# Altium schematic sheet Top.SchDoc
size A2; SheetNumber: 2; SheetTotal: 9
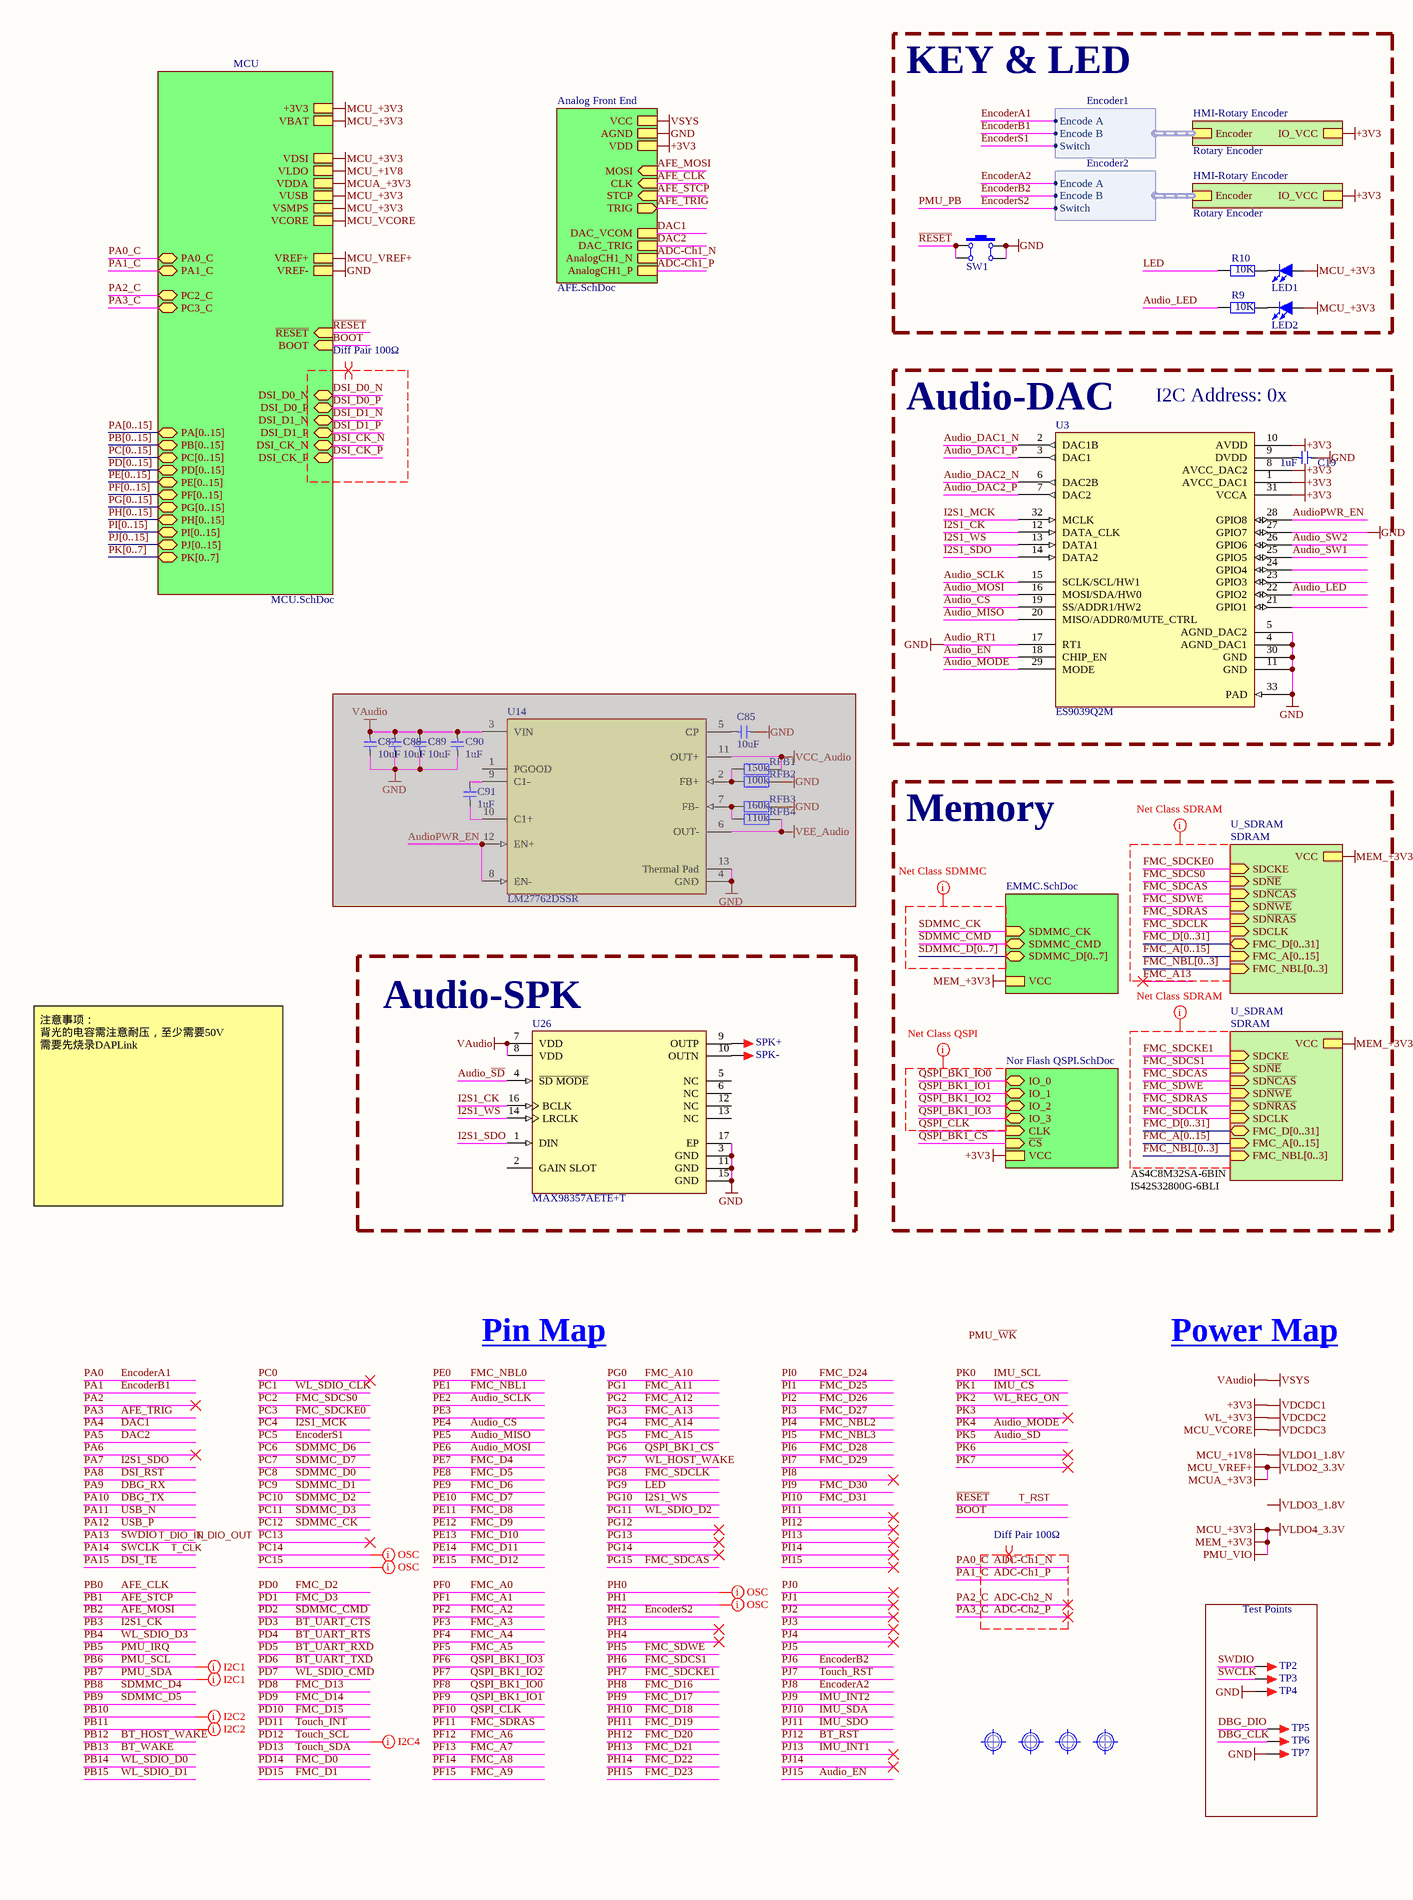
[diagram p0: Top.SchDoc, left]
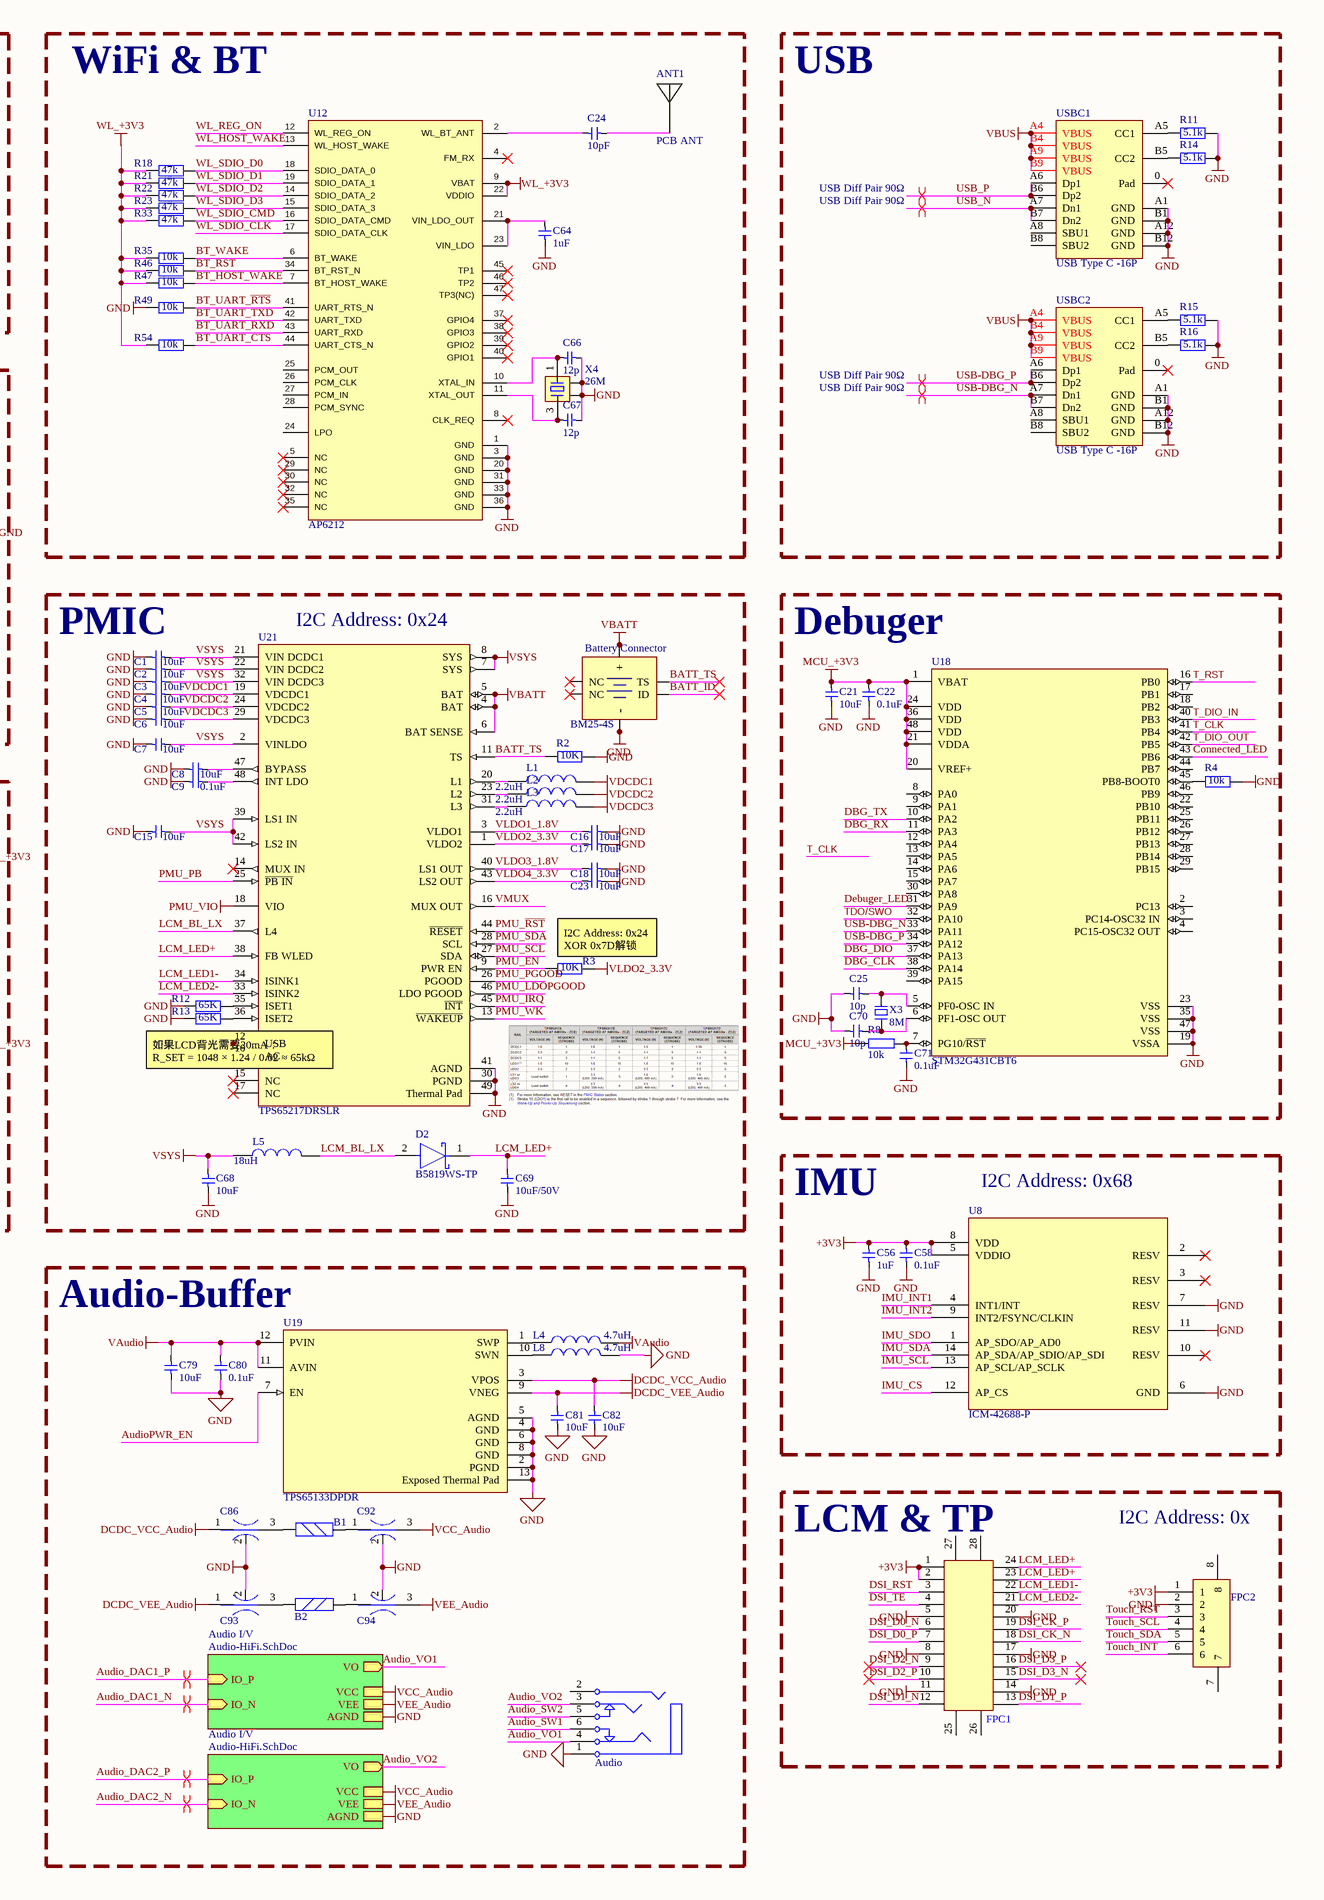
[diagram p1: Top.SchDoc, right]

## Parts
ANT1  PCB ANT  [WIFI-ANT]
Audio  PJ342  [PJ342A]  (value not drawn)
B1  BLM15AG601SN1D  [L0603]  (value not drawn)
B2  BLM15AG601SN1D  [L0603]  (value not drawn)
Battery_Connector  BM25-4S  [BM25-4S/2-V-51]
C1  10uF  [0603-C]
C2  10uF  [0603-C]
C3  10uF  [0603-C]
C4  10uF  [0603-C]
C5  10uF  [0603-C]
C6  10uF  [0603-C]
C7  10uF  [0603-C]
C8  10uF  [0603-C]
C9  0.1uF  [0603-C]
C15  10uF  [0603-C]
C16  10uF  [0603-C]
C17  10uF  [0603-C]
C18  10uF  [0603-C]
C19  1uF  [0402-C]
C21  10uF  [0402-C]
C22  0.1uF  [0402-C]
C23  10uF  [0603-C]
C24  10pF  [0402-C]
C25  10p  [0402-C]
C56  1uF  [0402-C]
C58  0.1uF  [0402-C]
C64  1uF  [0402-C]
C66  12p  [0402-C]
C67  12p  [0402-C]
C68  10uF  [0603-C]
C69  10uF/50V  [0603-C]
C70  10p  [0402-C]
C71  0.1uF  [0402-C]
C79  10uF  [0402-C]
C80  0.1uF  [0402-C]
C81  10uF  [0402-C]
C82  10uF  [0402-C]
C85  10uF  [0402-C]  (masked out: inside a compile mask, not in the netlist)
C86  NFM18PS105D0J3D  [FP-NFM18-0_1-e0_05_0_35-MFG]  (value not drawn)
C87  10uF  [0402-C]  (masked out: inside a compile mask, not in the netlist)
C88  10uF  [0402-C]  (masked out: inside a compile mask, not in the netlist)
C89  10uF  [0402-C]  (masked out: inside a compile mask, not in the netlist)
C90  1uF  [0402-C]  (masked out: inside a compile mask, not in the netlist)
C91  1uF  [0402-C]  (masked out: inside a compile mask, not in the netlist)
C92  NFM18PS105D0J3D  [FP-NFM18-0_1-e0_05_0_35-MFG]  (value not drawn)
C93  NFM18PS105D0J3D  [FP-NFM18-0_1-e0_05_0_35-MFG]  (value not drawn)
C94  NFM18PS105D0J3D  [FP-NFM18-0_1-e0_05_0_35-MFG]  (value not drawn)
D2  B5819WS-TP  [FP-SOD-323-IPC_C]
FPC1  OK-06F024-04  [OK-06F024-04]  (value not drawn)
FPC2  AFC01-S06FCA-00  [FPC-SMD_P0.50-6P_AFC01-S06FCA-00]  (value not drawn)
L1  2.2uH  [L0805]
L2  2.2uH  [L0805]
L3  2.2uH  [L0805]
L4  4.7uH  [L0805]
L5  18uH  [L0805]
L8  4.7uH  [L0805]
LED1  红色  [LED0603_B]  (value not drawn)
LED2  红色  [LED0603_B]  (value not drawn)
MR1  MARK1.6  [Mark 1]  (value not drawn)
MR2  MARK1.6  [Mark 1]  (value not drawn)
MR3  MARK1.6  [Mark 1]  (value not drawn)
MR4  MARK1.6  [Mark 1]  (value not drawn)
R2  10K  [0402-R]
R3  10K  [0603-R]
R4  10k  [0402-R]
R8  10k  [0402-R]
R9  10K  [0402-R]
R10  10K  [0402-R]
R11  5.1k  [0402-R]
R12  65K  [0402-R]
R13  65K  [0402-R]
R14  5.1k  [0402-R]
R15  5.1k  [0402-R]
R16  5.1k  [0402-R]
R18  47k  [0402-R]
R21  47k  [0402-R]
R22  47k  [0402-R]
R23  47k  [0402-R]
R33  47k  [0402-R]
R35  10k  [0402-R]
R46  10k  [0402-R]
R47  10k  [0402-R]
R49  10k  [0402-R]
R54  10k  [0402-R]
RFB1  150k  [0402-R]  (masked out: inside a compile mask, not in the netlist)
RFB2  100k  [0402-R]  (masked out: inside a compile mask, not in the netlist)
RFB3  160k  [0402-R]  (masked out: inside a compile mask, not in the netlist)
RFB4  110k  [0402-R]  (masked out: inside a compile mask, not in the netlist)
SPK+  (no value)  [SMD_L2.2-W1.0_KH-221020-TP]
SPK-  (no value)  [SMD_L2.2-W1.0_KH-221020-TP]
SW1  TD-1187SA-250  [SW-SMD-3.5*3.0_4P]  (value not drawn)
TP2  (no value)  [TEST 1]
TP3  (no value)  [TEST 1]
TP4  (no value)  [TEST 1]
TP5  (no value)  [SMD_L2.2-W1.0_KH-221020-TP]
TP6  (no value)  [SMD_L2.2-W1.0_KH-221020-TP]
TP7  (no value)  [TEST 1]
U3  ES9039Q2M  [QFN32 5x5_L]
U8  ICM-42688-P  [LGA-14_L3.0-W2.5-P0.50-TL]
U12  AP6212  [QFN-44_L12.0-W12.0-P0.90-TL]
U14  LM27762DSSR  [FP-DSS0012B-MFG]  (masked out: inside a compile mask, not in the netlist)
U18  STM32G431CBT6  [FP-LQFP48-5B-MFG]
U19  TPS65133DPDR  [FP-DPD0012A-MFG]
U21  TPS65217DRSLR  [FP-RSL0048A-MFG]
U26  MAX98357AETE+T  [FP-T1633-4-MFG]
USBC1  USB Type C -16P  [USB-C-SMD_16P]
USBC2  USB Type C -16P  [USB-C-SMD_16P]
X3  8M  [XTAL-3215-2P]
X4  26M  [XTAL-3225-4P]

## Blocks framed on the sheet
KEY & LED: LED1 LED2 R9 R10 SW1
WiFi & BT: ANT1 C24 C64 C66 C67 R18 R21-R23 R33 R35 R46 R47 R49 R54 U12 X4
USB: R11 R14-R16 USBC1 USBC2
Audio-DAC: C19 U3
PMIC: Battery_Connector C1-C9 C15-C18 C23 C68 C69 D2 L1-L3 L5 R2 R3 R12 R13 U21
Debuger: C21 C22 C25 C70 C71 R4 R8 U18 X3
Audio-SPK: SPK+ SPK- U26
IMU: C56 C58 U8
Audio-Buffer: Audio B1 B2 C79-C82 C86 C92-C94 L4 L8 U19
LCM & TP: FPC1 FPC2
Test Points: TP2-TP7

## Sub-sheets
Analog Front End = AFE.SchDoc: AGND, VCC, AnalogCH1_N, AnalogCH1_P, TRIG (out), MOSI (in), CLK (in), STCP (in), VDD, DAC_TRIG, DAC_VCOM
Audio I/V = Audio-HiFi.SchDoc: IO_N (in), IO_P (in), VO (out), VCC, VEE, AGND
Audio I/V = Audio-HiFi.SchDoc: IO_N (in), IO_P (in), VO (out), VCC, VEE, AGND
HMI-Rotary Encoder = Rotary Encoder: Encoder (harness Encoder1), IO_VCC
HMI-Rotary Encoder = Rotary Encoder: Encoder (harness Encoder2), IO_VCC
MCU = MCU.SchDoc: VREF+, +3V3, BOOT (in), ~{RESET} (in), PA[0..15] (bidir), PB[0..15] (bidir), PC[0..15] (bidir), PD[0..15] (bidir), PE[0..15] (bidir), PF[0..15] (bidir), PG[0..15] (bidir), PH[0..15] (bidir), PI[0..15] (bidir), PJ[0..15] (bidir), PK[0..7] (bidir), PA0_C (bidir), PA1_C (bidir), PC2_C (bidir), PC3_C (bidir), DSI_D0_N (bidir), DSI_D0_P (bidir), DSI_D1_N (bidir), DSI_D1_P (bidir), DSI_CK_N (bidir), DSI_CK_P (bidir), VBAT, VREF-, VDSI, VLDO, VDDA, VUSB, VSMPS, VCORE
U_EMMC = EMMC.SchDoc: SDMMC_D[0..7] (bidir), SDMMC_CMD (bidir), SDMMC_CK (in), VCC
U_Nor Flash = Nor Flash QSPI.SchDoc: IO_0 (bidir), IO_1 (bidir), IO_2 (bidir), IO_3 (bidir), CLK (in), ~{CS} (in), VCC
U_SDRAM = SDRAM: SD~{NCAS} (in), SD~{NWE} (in), SD~{NRAS} (in), SD~{NE} (in), SDCKE (in), SDCLK (in), FMC_D[0..31] (bidir), FMC_A[0..15] (in), FMC_NBL[0..3] (in), VCC
U_SDRAM = SDRAM: SD~{NCAS} (in), SD~{NWE} (in), SD~{NRAS} (in), SD~{NE} (in), SDCKE (in), SDCLK (in), FMC_D[0..31] (bidir), FMC_A[0..15] (in), FMC_NBL[0..3] (in), VCC

## Harnesses
Encoder1: Encode A, Encode B, Switch
Encoder2: Encode A, Encode B, Switch

## Nets
Audio_RT1: Audio.1 Battery_Connector.7(-) Battery_Connector.8(-) Battery_Connector.11(-) Battery_Connector.12(-) Battery_Connector.15(-) Battery_Connector.16(-) C1.2 C2.2 C3.2 C4.2 C5.2 C6.2 C7.2 C8.2 C9.2 C15.2 C16.1 C17.1 C18.1 C19.2 C21.1 C22.1 C23.1 C25.1 C56.1 C58.1 C64.1 C66.2 C67.2 C68.1 C69.1 C70.1 C71.2 C79.1 C80.1 C81.1 C82.1 C86.2(GND) C92.2(GND) C93.2(GND) C94.2(GND) FPC1.5 FPC1.8 FPC1.11 FPC1.14 FPC1.17 FPC1.20 FPC2.2 L8.2 R2.2 R4.1 R11.2 R12.1 R13.1 R14.2 R15.2 R16.2 R49.1 SW1.2 SW1.3 TP4.1 TP7.1 U3.4(AGND_DAC1) U3.5(AGND_DAC2) U3.11(GND) U3.17(RT1) U3.27(GPIO7) U3.30(GND) U3.33(PAD) U8.6(GND) U8.7(RESV) U8.11(RESV) U12.1(GND) U12.3(GND) U12.20(GND) U12.31(GND) U12.33(GND) U12.36(GND) U18.19(VSSA) U18.23(VSS) U18.35(VSS) U18.47(VSS) U19.2(PGND) U19.4(GND) U19.5(AGND) U19.6(GND) U19.8(GND) U19.13(Exposed_Thermal_Pad) U21.30(PGND) U21.41(AGND) U21.49(Thermal_Pad) U26.3(GND) U26.11(GND) U26.15(GND) U26.17(EP) USBC1.A1(GND) USBC1.A12(GND) USBC1.B1(GND) USBC1.B12(GND) USBC2.A1(GND) USBC2.A12(GND) USBC2.B1(GND) USBC2.B12(GND) X4.2 X4.4 ; sheet MCU/VREF-, sheet Analog Front End/AGND, sheet Audio I/V/AGND, sheet Audio I/V/AGND  [also labelled GND]
DCDC_VCC_Audio: C82.2 C86.1(Input) U19.3(VPOS)
DCDC_VEE_Audio: C81.2 C93.1(Input) U19.9(VNEG)
VBATT: Battery_Connector.1(+) Battery_Connector.2(+) Battery_Connector.9(+) Battery_Connector.10(+) Battery_Connector.13(+) Battery_Connector.14(+) U21.4(BAT) U21.5(BAT) U21.6(BAT_SENSE)
VBUS: U21.10(AC) U21.12(USB) USBC1.A4(VBUS) USBC1.A9(VBUS) USBC1.B4(VBUS) USBC1.B9(VBUS) USBC2.A4(VBUS) USBC2.A9(VBUS) USBC2.B4(VBUS) USBC2.B9(VBUS)
VCC_Audio: C92.3(Output) ; sheet Audio I/V/VCC, sheet Audio I/V/VCC
VDCDC1: C4.1 C56.2 C58.2 FPC1.1 FPC1.2 FPC2.1 L1.2 U3.1(AVCC_DAC1) U3.8(AVCC_DAC2) U3.10(AVDD) U3.31(VCCA) U8.5(VDDIO) U8.8(VDD) U21.19(VDCDC1) ; sheet HMI-Rotary Encoder/IO_VCC, sheet HMI-Rotary Encoder/IO_VCC, sheet Analog Front End/VDD, sheet U_Nor Flash/VCC  [also labelled +3V3]
VDCDC2: C5.1 L2.2 R18.1 R21.1 R22.1 R23.1 R33.1 R35.1 R46.1 R47.1 R54.1 U12.9(VBAT) U12.22(VDDIO) U21.24(VDCDC2)  [also labelled WL_+3V3]
VDCDC3: C6.1 L3.2 U21.29(VDCDC3) ; sheet MCU/VCORE  [also labelled MCU_VCORE]
VEE_Audio: C94.3(Output) ; sheet Audio I/V/VEE, sheet Audio I/V/VEE
VLDO1_1.8V: C16.2 U21.3(VLDO1) ; sheet MCU/VLDO  [also labelled MCU_+1V8]
VLDO2_3.3V: C17.2 R3.2 U21.1(VLDO2) ; sheet MCU/VREF+, sheet MCU/VDDA  [also labelled MCU_VREF+, MCUA_+3V3]
VLDO3_1.8V: C18.2 U21.40(LS1_OUT)
VLDO4_3.3V: C21.2 C22.2 C23.2 LED1.1(A) LED2.1(A) R8.1 U18.1(VBAT) U18.20(VREF+) U18.21(VDDA) U18.24(VDD) U18.36(VDD) U18.48(VDD) U21.18(VIO) U21.43(LS2_OUT) ; sheet MCU/+3V3, sheet MCU/VBAT, sheet MCU/VDSI, sheet MCU/VUSB, sheet MCU/VSMPS, sheet U_SDRAM/VCC, sheet U_SDRAM/VCC, sheet U_EMMC/VCC  [also labelled MCU_+3V3, MEM_+3V3, PMU_VIO]
VSYS: C1.1 C2.1 C3.1 C7.1 C15.1 C68.2 C79.2 C80.2 L4.2 L5.1 U19.11(AVIN) U19.12(PVIN) U21.2(VINLDO) U21.7(SYS) U21.8(SYS) U21.21(VIN_DCDC1) U21.22(VIN_DCDC2) U21.32(VIN_DCDC3) U21.39(LS1_IN) U21.42(LS2_IN) U26.7(VDD) U26.8(VDD) ; sheet Analog Front End/VCC  [also labelled VAudio]
ADC-Ch1_N: sheet MCU/PA0_C, sheet Analog Front End/AnalogCH1_N  [also labelled PA0_C]
ADC-Ch1_P: sheet MCU/PA1_C, sheet Analog Front End/AnalogCH1_P  [also labelled PA1_C]
ADC-Ch2_N: sheet MCU/PC2_C  [also labelled PA2_C]
ADC-Ch2_P: sheet MCU/PC3_C  [also labelled PA3_C]
AFE_CLK: sheet Analog Front End/CLK  [also labelled PB0]
AFE_MOSI: sheet Analog Front End/MOSI  [also labelled PB2]
AFE_STCP: sheet Analog Front End/STCP  [also labelled PB1]
AFE_TRIG: sheet Analog Front End/TRIG  [also labelled PA3]
Audio_CS: U3.19(SS/ADDR1/HW2)  [also labelled PE4]
Audio_DAC1_N: U3.2(DAC1B) ; sheet Audio I/V/IO_N
Audio_DAC1_P: U3.3(DAC1) ; sheet Audio I/V/IO_P
Audio_DAC2_N: U3.6(DAC2B) ; sheet Audio I/V/IO_N
Audio_DAC2_P: U3.7(DAC2) ; sheet Audio I/V/IO_P
Audio_EN: U3.18(CHIP_EN)  [also labelled PJ15]
Audio_LED: R9.1 U3.22(GPIO2)
Audio_MISO: U3.20(MISO/ADDR0/MUTE_CTRL)  [also labelled PE5]
Audio_MODE: U3.29(MODE)  [also labelled PK4]
Audio_MOSI: U3.16(MOSI/SDA/HW0)  [also labelled PE6]
Audio_~{SD}: U26.4(~{SD_MODE})  [also labelled PK5]
Audio_SCLK: U3.15(SCLK/SCL/HW1)  [also labelled PE2]
Audio_SW1: Audio.6 U3.25(GPIO5)
Audio_SW2: Audio.5 U3.26(GPIO6)
Audio_VO1: Audio.4 ; sheet Audio I/V/VO
Audio_VO2: Audio.3 ; sheet Audio I/V/VO
AudioPWR_EN: U3.28(GPIO8) U19.7(EN)
BATT_ID: Battery_Connector.4(ID)
BATT_TS: Battery_Connector.3(TS) R2.1 U21.11(TS)
BOOT: sheet MCU/BOOT
BT_HOST_WAKE: R47.2 U12.7(BT_HOST_WAKE)  [also labelled PB12]
BT_~{RST}: R46.2 U12.34(BT_RST_N)  [also labelled PJ12]
BT_UART_~{CTS}: R54.2 U12.44(UART_CTS_N)  [also labelled PD3]
BT_UART_~{RTS}: R49.2 U12.41(UART_RTS_N)  [also labelled PD4]
BT_UART_RXD: U12.43(UART_RXD)  [also labelled PD5]
BT_UART_TXD: U12.42(UART_TXD)  [also labelled PD6]
BT_WAKE: R35.2 U12.6(BT_WAKE)  [also labelled PB13]
Connected_LED: U18.43(PB6)
DAC1: sheet Analog Front End/DAC_VCOM  [also labelled PA4]
DAC2: sheet Analog Front End/DAC_TRIG  [also labelled PA5]
DBG_CLK: TP6.1 U18.38(PA14)
DBG_DIO: TP5.1 U18.37(PA13)
DBG_RX: U18.11(PA3)  [also labelled PA9]
DBG_TX: U18.10(PA2)  [also labelled PA10]
Debuger_LED: U18.31(PA9)
DSI_CK_N: FPC1.18 ; sheet MCU/DSI_CK_N
DSI_CK_P: FPC1.19 ; sheet MCU/DSI_CK_P
DSI_D0_N: FPC1.6 ; sheet MCU/DSI_D0_N
DSI_D0_P: FPC1.7 ; sheet MCU/DSI_D0_P
DSI_D1_N: FPC1.12 ; sheet MCU/DSI_D1_N
DSI_D1_P: FPC1.13 ; sheet MCU/DSI_D1_P
DSI_D2_N: FPC1.9
DSI_D2_P: FPC1.10
DSI_D3_N: FPC1.15
DSI_D3_P: FPC1.16
DSI_RST: FPC1.3  [also labelled PA8]
DSI_TE: FPC1.4  [also labelled PA15]
EncoderA1: sheet HMI-Rotary Encoder/Encoder.Encode A  [also labelled PA0]
EncoderA2: sheet HMI-Rotary Encoder/Encoder.Encode A  [also labelled PJ8]
EncoderB1: sheet HMI-Rotary Encoder/Encoder.Encode B  [also labelled PA1]
EncoderB2: sheet HMI-Rotary Encoder/Encoder.Encode B  [also labelled PJ6]
EncoderS1: sheet HMI-Rotary Encoder/Encoder.Switch  [also labelled PC5]
EncoderS2: U21.25(~{PB_IN}) ; sheet HMI-Rotary Encoder/Encoder.Switch  [also labelled PH2, PMU_PB]
FMC_SD~{CAS}: sheet U_SDRAM/SD~{NCAS}, sheet U_SDRAM/SD~{NCAS}  [also labelled PG15]
FMC_SD~{CS}0: sheet U_SDRAM/SD~{NE}  [also labelled PC2]
FMC_SD~{CS}1: sheet U_SDRAM/SD~{NE}  [also labelled PH6]
FMC_SDCKE0: sheet U_SDRAM/SDCKE  [also labelled PC3]
FMC_SDCKE1: sheet U_SDRAM/SDCKE  [also labelled PH7]
FMC_SDCLK: sheet U_SDRAM/SDCLK, sheet U_SDRAM/SDCLK  [also labelled PG8]
FMC_SD~{RAS}: sheet U_SDRAM/SD~{NRAS}, sheet U_SDRAM/SD~{NRAS}  [also labelled PF11]
FMC_SD~{WE}: sheet U_SDRAM/SD~{NWE}, sheet U_SDRAM/SD~{NWE}  [also labelled PH5]
I2S1_CK: U3.12(DATA_CLK) U26.16(BCLK)  [also labelled PB3]
I2S1_MCK: U3.32(MCLK)  [also labelled PC4]
I2S1_SDO: U3.14(DATA2) U26.1(DIN)  [also labelled PA7]
I2S1_WS: U3.13(DATA1) U26.14(LRCLK)  [also labelled PG10]
IMU_CS: U8.12(AP_CS)  [also labelled PK1]
IMU_INT1: U8.4(INT1/INT)  [also labelled PJ13]
IMU_INT2: U8.9(INT2/FSYNC/CLKIN)  [also labelled PJ9]
IMU_SCL: U8.13(AP_SCL/AP_SCLK)  [also labelled PK0]
IMU_SDA: U8.14(AP_SDA/AP_SDIO/AP_SDI)  [also labelled PJ10]
IMU_SDO: U8.1(AP_SDO/AP_AD0)  [also labelled PJ11]
LCM_BL_LX: D2.2(A) L5.2 U21.37(L4)
LCM_LED1-: FPC1.22 U21.34(ISINK1)
LCM_LED2-: FPC1.21 U21.33(ISINK2)
LCM_LED+: C69.2 D2.1(C) FPC1.23 FPC1.24 U21.38(FB_WLED)
LED: R10.1  [also labelled PG9]
PA11: USBC1.A7(Dn1) USBC1.B7(Dn2)  [also labelled USB_N]
PA12: USBC1.A6(Dp1) USBC1.B6(Dp2)  [also labelled USB_P]
PA13: TP2.1 U18.40(PB3) U18.42(PB5)  [also labelled SWDIO, T_DIO_IN, T_DIO_OUT]
PA14: TP3.1 U18.41(PB4)  [also labelled SWCLK, T_CLK]
PB4: R23.2 U12.15(SDIO_DATA_3)  [also labelled WL_SDIO_D3]
PB5: U21.45(~{INT})  [also labelled PMU_~{IRQ}]
PB6: U21.27(SDA)  [also labelled PMU_SCL]
PB7: U21.28(SCL)  [also labelled PMU_SDA]
PB14: R18.2 U12.18(SDIO_DATA_0)  [also labelled WL_SDIO_D0]
PB15: R21.2 U12.19(SDIO_DATA_1)  [also labelled WL_SDIO_D1]
PC1: U12.17(SDIO_DATA_CLK)  [also labelled WL_SDIO_CLK]
PC12: sheet U_EMMC/SDMMC_CK  [also labelled SDMMC_CK]
PD2: sheet U_EMMC/SDMMC_CMD  [also labelled SDMMC_CMD]
PD7: R33.2 U12.16(SDIO_DATA_CMD)  [also labelled WL_SDIO_CMD]
PD11: FPC2.6  [also labelled Touch_INT]
PD12: FPC2.4  [also labelled Touch_SCL]
PD13: FPC2.5  [also labelled Touch_SDA]
PF6: sheet U_Nor Flash/IO_3  [also labelled QSPI_BK1_IO3]
PF7: sheet U_Nor Flash/IO_2  [also labelled QSPI_BK1_IO2]
PF8: sheet U_Nor Flash/IO_0  [also labelled QSPI_BK1_IO0]
PF9: sheet U_Nor Flash/IO_1  [also labelled QSPI_BK1_IO1]
PF10: sheet U_Nor Flash/CLK  [also labelled QSPI_CLK]
PG6: sheet U_Nor Flash/~{CS}  [also labelled QSPI_BK1_~{CS}]
PG7: U12.13(WL_HOST_WAKE)  [also labelled WL_HOST_WAKE]
PG11: R22.2 U12.14(SDIO_DATA_2)  [also labelled WL_SDIO_D2]
PJ7: FPC2.3  [also labelled Touch_RST]
PK2: U12.12(WL_REG_ON)  [also labelled WL_REG_ON]
PMU_EN: R3.1 U21.9(PWR_EN)
PMU_LDOPGOOD: U21.46(LDO_PGOOD)
PMU_PGOOD: U21.26(PGOOD)
PMU_~{RST}: U21.44(~{RESET})
PMU_~{WK}: U21.13(~{WAKEUP})
~{RESET}: SW1.1 SW1.4 U18.16(PB0) ; sheet MCU/~{RESET}  [also labelled T_RST]
TDO/SWO: U18.32(PA10)
USB-DBG_N: U18.33(PA11) USBC2.A7(Dn1) USBC2.B7(Dn2)
USB-DBG_P: U18.34(PA12) USBC2.A6(Dp1) USBC2.B6(Dp2)
VMUX: U21.16(MUX_OUT)
NetANT1_1: ANT1.1 C24.2
NetB1_1: B1.1 C92.1(Input)
NetB1_2: B1.2 C86.3(Output)
NetB2_1: B2.1 C94.1(Input)
NetB2_2: B2.2 C93.3(Output)
NetC8_1: C8.1 U21.47(BYPASS)
NetC9_1: C9.1 U21.48(INT_LDO)
NetC19_1: C19.1 U3.9(DVDD)
NetC24_1: C24.1 U12.2(WL_BT_ANT)
NetC25_2: C25.2 U18.5(PF0-OSC_IN) X3.2
NetC64_2: C64.2 U12.21(VIN_LDO_OUT) U12.23(VIN_LDO)
NetC66_1: C66.1 U12.10(XTAL_IN) X4.1
NetC67_1: C67.1 U12.11(XTAL_OUT) X4.3
NetC70_2: C70.2 U18.6(PF1-OSC_OUT) X3.1
NetC71_1: C71.1 R8.2 U18.7(PG10/~{RST})
NetL1_1: L1.1 U21.20(L1)
NetL2_1: L2.1 U21.23(L2)
NetL3_1: L3.1 U21.31(L3)
NetL4_1: L4.1 U19.1(SWP)
NetL8_1: L8.1 U19.10(SWN)
NetLED1_2: LED1.2(K) R10.2
NetLED2_2: LED2.2(K) R9.2
NetR4_2: R4.2 U18.45(PB8-BOOT0)
NetR11_1: R11.1 USBC1.A5(CC1)
NetR12_2: R12.2 U21.35(ISET1)
NetR13_2: R13.2 U21.36(ISET2)
NetR14_1: R14.1 USBC1.B5(CC2)
NetR15_1: R15.1 USBC2.A5(CC1)
NetR16_1: R16.1 USBC2.B5(CC2)
NetSPK+_1: SPK+.1 U26.9(OUTP)
NetSPK-_1: SPK-.1 U26.10(OUTN)

Not connected (* = marked no-connect by the designer): Audio 2; Battery_Connector 5(NC)* 6(NC)*; FPC1 25 26 27 28; FPC2 7 8; U3 21(GPIO1) 23(GPIO3) 24(GPIO4); U8 2(RESV)* 3(RESV)* 10(RESV)*; U12 4(FM_RX)* 5(NC)* 8(CLK_REQ)* 24(LPO) 25(PCM_OUT) 26(PCM_CLK) 27(PCM_IN) 28(PCM_SYNC) 29(NC)* 30(NC)* 32(NC)* 35(NC)* 37(GPIO4)* 38(GPIO3)* 39(GPIO2)* 40(GPIO1)* 45(TP1)* 46(TP2)* 47(TP3(NC))*; U18 2(PC13) 3(PC14-OSC32_IN) 4(PC15-OSC32_OUT) 8(PA0) 9(PA1) 12(PA4) 13(PA5) 14(PA6) 15(PA7) 17(PB1) 18(PB2) 22(PB10) 25(PB11) 26(PB12) 27(PB13) 28(PB14) 29(PB15) 30(PA8) 39(PA15) 44(PB7) 46(PB9); U21 14(MUX_IN)* 15(NC)* 17(NC)*; U26 2(GAIN_SLOT) 5(NC) 6(NC) 12(NC) 13(NC); USBC1 0(Pad)* A8(SBU1) B8(SBU2); USBC2 0(Pad)* A8(SBU1) B8(SBU2)

## Buses and harness runs
bus FMC_A[0..15] = sheet U_SDRAM/FMC_A[0..15]
bus FMC_D[0..31] = sheet U_SDRAM/FMC_D[0..31]
bus FMC_NBL[0..3] = sheet U_SDRAM/FMC_NBL[0..3]
bus PA[0..15] = sheet MCU/PA[0..15]
bus PB[0..15] = sheet MCU/PB[0..15]
bus PC[0..15] = sheet MCU/PC[0..15]
bus PD[0..15] = sheet MCU/PD[0..15]
bus PE[0..15] = sheet MCU/PE[0..15]
bus PF[0..15] = sheet MCU/PF[0..15]
bus PG[0..15] = sheet MCU/PG[0..15]
bus PH[0..15] = sheet MCU/PH[0..15]
bus PI[0..15] = sheet MCU/PI[0..15]
bus PJ[0..15] = sheet MCU/PJ[0..15]
bus PK[0..7] = sheet MCU/PK[0..7]
bus SDMMC_D[0..7] = sheet U_EMMC/SDMMC_D[0..7]

## Layout directives
differential pair; Parameter 1: Diff Pair 100Ω; rule Differential Pairs Routing [Pref Gap = 6mil    Min Gap  = 4mil    Max Gap  = 10milPref Width = 6mil    Min Width  = 4mil    Max Width  = 15mil]; differential pair class MIPI; net class MIPI; rule Matched Net Lengths [Tolerance = 50mil]: DSI_CK_N, DSI_CK_P, DSI_D0_N, DSI_D0_P, DSI_D1_N, DSI_D1_P
differential pair; Parameter 1: Diff Pair 100Ω; rule Differential Pairs Routing [Pref Gap = 6mil    Min Gap  = 4mil    Max Gap  = 10milPref Width = 6mil    Min Width  = 4mil    Max Width  = 15mil]; differential pair class ADC; net class ADC; rule Matched Net Lengths [Tolerance = 50mil]: ADC-Ch1_N, ADC-Ch1_P, ADC-Ch2_N, ADC-Ch2_P
net class SDRAM1: FMC_A13, FMC_A[0..15], FMC_D[0..31], FMC_NBL[0..3], FMC_SDCKE0, FMC_SDCLK, FMC_SD~{CAS}, FMC_SD~{CS}0, FMC_SD~{RAS}, FMC_SD~{WE}
net class QSPI; rule Matched Net Lengths [Tolerance = 100mil]: QSPI_BK1_IO0, QSPI_BK1_IO1, QSPI_BK1_IO2, QSPI_BK1_IO3, QSPI_CLK
net class SDMMC; rule Matched Net Lengths [Tolerance = 100mil]: SDMMC_CK, SDMMC_CMD, SDMMC_D[0..7]
net class SDRAM2: FMC_A[0..15], FMC_D[0..31], FMC_NBL[0..3], FMC_SDCKE1, FMC_SDCLK, FMC_SD~{CAS}, FMC_SD~{CS}1, FMC_SD~{RAS}, FMC_SD~{WE}
I2C Address:: 0X: PB6, PC14, PC15, PH0, PH1
mark named I2C1: PB7
mark named I2C2: PB10, PB11
differential pair; Parameter 1: USB Diff Pair 90Ω; rule Differential Pairs Routing [Pref Gap = 6mil    Min Gap  = 4mil    Max Gap  = 10milPref Width = 6mil    Min Width  = 4mil    Max Width  = 15mil]; differential pair class USB: PA11, PA12, USB-DBG_N, USB-DBG_P
differential pair: Audio_DAC1_N, Audio_DAC1_P, Audio_DAC2_N, Audio_DAC2_P
mark named I2C4: PD12

## Notes on the sheet
- I2C Address: 0x
- (near U21) I2C Address: 0x24
- Memory
- (near R3) I2C Address: 0x24
  XOR 0x7D解锁
- (near U21) 如果LCD背光需要20mA：
  R_SET = 1048 × 1.24 / 0.02 ≈ 65kΩ
- 注意事项：
  背光的电容需注意耐压，至少需要50V
  需要先烧录DAPLink
- AS4C8M32SA-6BIN
  IS42S32800G-6BLI
- I2C Address: 0x68
- Pin Map
- Power Map
- Labels drawn without touching a wire or pin: PMU_~{WK}, VLDO3_1.8V

## Library data of the parts
ANT1 = ANT1: PCB板载天线; 当前库版本V2023.8.14 @淘宝卖家:黄晶宝石: 最新版本发布https://item.taobao.com/item.htm?id=566775463719; 联系下单店铺卖家 免费技术支持: 联系下单店铺卖家 免费帮你查找封装; BOM名称: PCB板载天线
Audio = PJ342: 3.5耳机插座,4Pin; BOM名称: 耳机插座; 当前库版本V2023.8.14 @淘宝卖家:黄晶宝石: 最新版本发布https://item.taobao.com/item.htm?id=566775463719
B1 B2 = BEAD
Battery_Connector = BM25-4S/2-V-51: Battery
C1-C9 C15-C19 C21-C25 C56 C58 C64 C66-C71 C79-C82 C85 C87-C91 = 电容-0402: Capacitor; Value: 0.1u
C86 C92-C94 = CMP-06053-000028-1: CAP FEEDTHRU 1UF 20% 6.3V 0603; DC Resistance (DCR): 30mR; Current: 2A; Length: 0.063inch; Package Quantity: 4000; Capacitance: 1uF; Height: 0.028inch; Mount: Surface Mount; Max Operating Temperature: 125°C; Voltage Rating: 6.3V; Case/Package: 0603; Tolerance: 20%; Case Code (Metric): 1608; Min Operating Temperature: -55°C; Packaging: Tape and Reel; Case Code (Imperial): 0603; Voltage Rating (DC): 6.3V; Width: 0.031inch
D2 = CMP-56206-000009-1: DIODE SCHOTTKY 40V 1A SOD323; Max Reverse Leakage Current: 1mA; Peak Non-Repetitive Surge Current: 10A; Forward Voltage: 900mV; Element Configuration: Single; Max Reverse Voltage (DC): 40V; Number of Pins: 2; Max Operating Temperature: 125°C; Package Quantity: 1; Radiation Hardening: No; Average Rectified Current: 1A; Lead Free: Lead Free; Series: -; Mount: Surface Mount; Min Operating Temperature: -65°C; RoHS Compliant: Yes; Packaging: Tape and Reel; Max Surge Current: 10A
FPC1 = OK-06F024-04: Convert to PCB: yes; Symbol: OK-06F024-04; Device: OK-06F024-04; Add into BOM: yes
FPC2 = AFC01-S06FCA-00: Manufacturer: JS(钜硕电子); Add into BOM: yes; Locking Feature: 翻盖式; Number of Contacts: 6P; Pitch: 0.5mm; FFC, FCB Thickness: 0.3mm; Symbol: AFC01-S06FCA-00; Device: AFC01-S06FCA-00; Supplier: LCSC; Supplier Part: C262655; Manufacturer Part: AFC01-S06FCA-00; JLCPCB Part Class: 扩展库; LCSC Part Name: 间距:0.5mm P数:6P 翻盖式 下接; Supplier Footprint: SMD,P=0.5mm,卧贴; Datasheet: https://atta.szlcsc.com/upload/public/pdf/source/20190816/C413942_2A72D1AC756EAE17EEDF756A339D4500.pdf; Convert to PCB: yes; Contact Type: 下接; Mounting Type: 卧贴; Height Above Board: 2mm
L1-L5 L8 = L: 贴片小功率电感; BOM名称: 小功率贴片电感; 联系下单店铺卖家 免费帮你查找封装: 联系下单店铺卖家 免费技术支持
LED1 LED2 = LED-SMD: 贴片LED; 联系卖家 免费查找封装: 封装库来自淘宝卖家ID：黄晶宝石; BOM名称: 贴片LED
MR1-MR4 = MARK: 光学定位点; 联系下单店铺卖家 免费技术支持: 联系下单店铺卖家 免费帮你查找封装; BOM名称: 光学定位点
R2-R4 R8-R16 R18 R21-R23 R33 R35 R46 R47 R49 R54 RFB1-RFB4 = R: 贴片电阻; 联系卖家，免费查找封装: 唯一出售店铺网址https://shop463601444.taobao.com; BOM名称: 贴片电阻
SPK+ SPK- TP2-TP7 = TEST: 测试点; 联系下单店铺卖家 免费技术支持: 联系下单店铺卖家 免费帮你查找封装; BOM名称: 测试点
SW1 = TD-1187SA-250: 小乌龟-侧按4脚开关 带定位柱; 联系下单店铺卖家 免费技术支持: 联系下单店铺卖家 免费帮你查找封装
U8 = ICM-42688-P: 6-axis MEMS
U12 = AP6212: WiFi & BT Module
U14 = CMP-04918-000139-2: IC REG CHARGE PUMP ADJ DL 12WSON; Min Output Voltage: 1.5V; Max Input Voltage: 5.5V; Synchronous Rectifier: No; Output Type: Adjustable; Output Current: 250mA; Min Input Voltage: 2.7V; Quiescent Current: 390uA; Switching Frequency: 2.3MHz; Max Output Voltage: 5V; Topology: Charge Pump; Lead Free: Lead Free; Min Operating Temperature: -40°C; Max Operating Temperature: 85°C; RoHS Compliant: Yes; Packaging: Tape and Reel; Mount: Surface Mount
U18 = CMP-12105-000030-1: MAINSTREAM ARM CORTEX-M4+ MCU 17; Manufacturer: STMicroelectronics; Number Of Adc Channels: 17; Number Of I/Os: 38; Standoff Height: 0.05mm; Number Of Usb Channels: 1; Data Bus Width: 32bits; Number Of I2C Channels: 3; Number Of Pwm Channels: 31; Frequency: 170MHz; Memory Type: FLASH; Number Of Timers/Counters: 14; Ram Size: 32KBytes; Max Junction Temp: +105°C; Memory Size: 128KBytes; Min Supply Voltage: 1.62V; Max Supply Voltage: 3.6V; Number Of Uart Channels: 4; Interface: I2C,SPI,UART,USART,CAN,USB,LIN,IrDA,I2S; Temperature Range Low: -40°C; Lead Free: Yes; Device Class L3: Microcontrollers; Number Of Cores: 1; Temperature Range High: +85°C; Height: 1.6mm; Digikey Description: MAINSTREAM ARM CORTEX-M4+ MCU 17; Device Class L1: Integrated Circuits (ICs); Package: LQFP48-5B; RoHS: TRUE; Number Of A/D Converters: 1; Core Architecture: Arm Cortex-M4; Device Class L2: Embedded Processors and Controllers; ComponentLink2Description: Datasheet; Temperature: -40°C to +85°C; Ambient Temperature Range High: +85°C; Ambient Temperature Range Low: -40°C; Octopart: https://octopart.com/stm32g431cbt6-stmicroelectronics-98835224; ComponentLink2URL: https://www.st.com/resource/en/datasheet/stm32g431cb.pdf; Automotive: No; Number Of Spi Channels: 3; Manufacturer Part Number: STM32G431CBT6; Category: IC
U19 = CMP-04918-000430-1: IC REG AMOLED DISPL 2OUT 12WSON; Number of Channels: 2; Max Supply Voltage: 5V; Min Supply Voltage: 2.9V; Output Voltage: -5V; Mount: Surface Mount; Case/Package: QFN; Packaging: Tape and Reel; Lead Free: Lead Free; Radiation Hardening: No; Min Operating Temperature: -40°C; Number of Outputs: 2; Max Operating Temperature: 85°C; Number of Pins: 12; RoHS Compliant: Yes; Package Quantity: 3000
U21 = CMP-1518-00018-3: IC PMIC BATT PWR SYST 48VQFN; Number of Outputs: 7; Output Current: 1.2A; Nominal Supply Current: 2.5A; Max Duty Cycle: 100%; Operating Supply Voltage: 5.8V; Output Voltage: 3.3V; Min Operating Temperature: -40°C; Radiation Hardening: No; Package Quantity: 2500; Number of Pins: 48; Mount: Surface Mount; Packaging: Tape and Reel; Lead Free: Lead Free; Max Operating Temperature: 105°C; Case/Package: VQFN; RoHS Compliant: Yes
U26 = CMP-05698-000018-1: IC AMP CLASS D MONO 3.2W 16TQFN; Max Supply Voltage: 5.5V; Max Output Current: 1.6A; Voltage Gain: 15dB; Max Power Dissipation: 1.666W; Min Supply Voltage: 2.5V; Power Supply Rejection Ratio (PSRR): 77dB; Series: -; Contact Plating: Tin; Min Operating Temperature: -40°C; Packaging: Tape and Reel; Max Output Power: 3.2W; Mount: Surface Mount; Number of Pins: 16; RoHS Compliant: Yes; Max Operating Temperature: 85°C; Radiation Hardening: No
USBC1 USBC2 = USB-Tyoe-C 16P-2.0: type-C-16pin
X3 = XTAL-2P: 2脚无源晶振(谐振器）; 联系下单店铺卖家 免费帮你查找封装: 联系下单店铺卖家 免费技术支持; BOM名称: 2脚无源晶振(谐振器）
X4 = XTAL-4P: 4脚无源晶振(谐振器）; 联系下单店铺卖家 免费帮你查找封装: 联系下单店铺卖家 免费技术支持; BOM名称: 4脚无源晶振(谐振器）